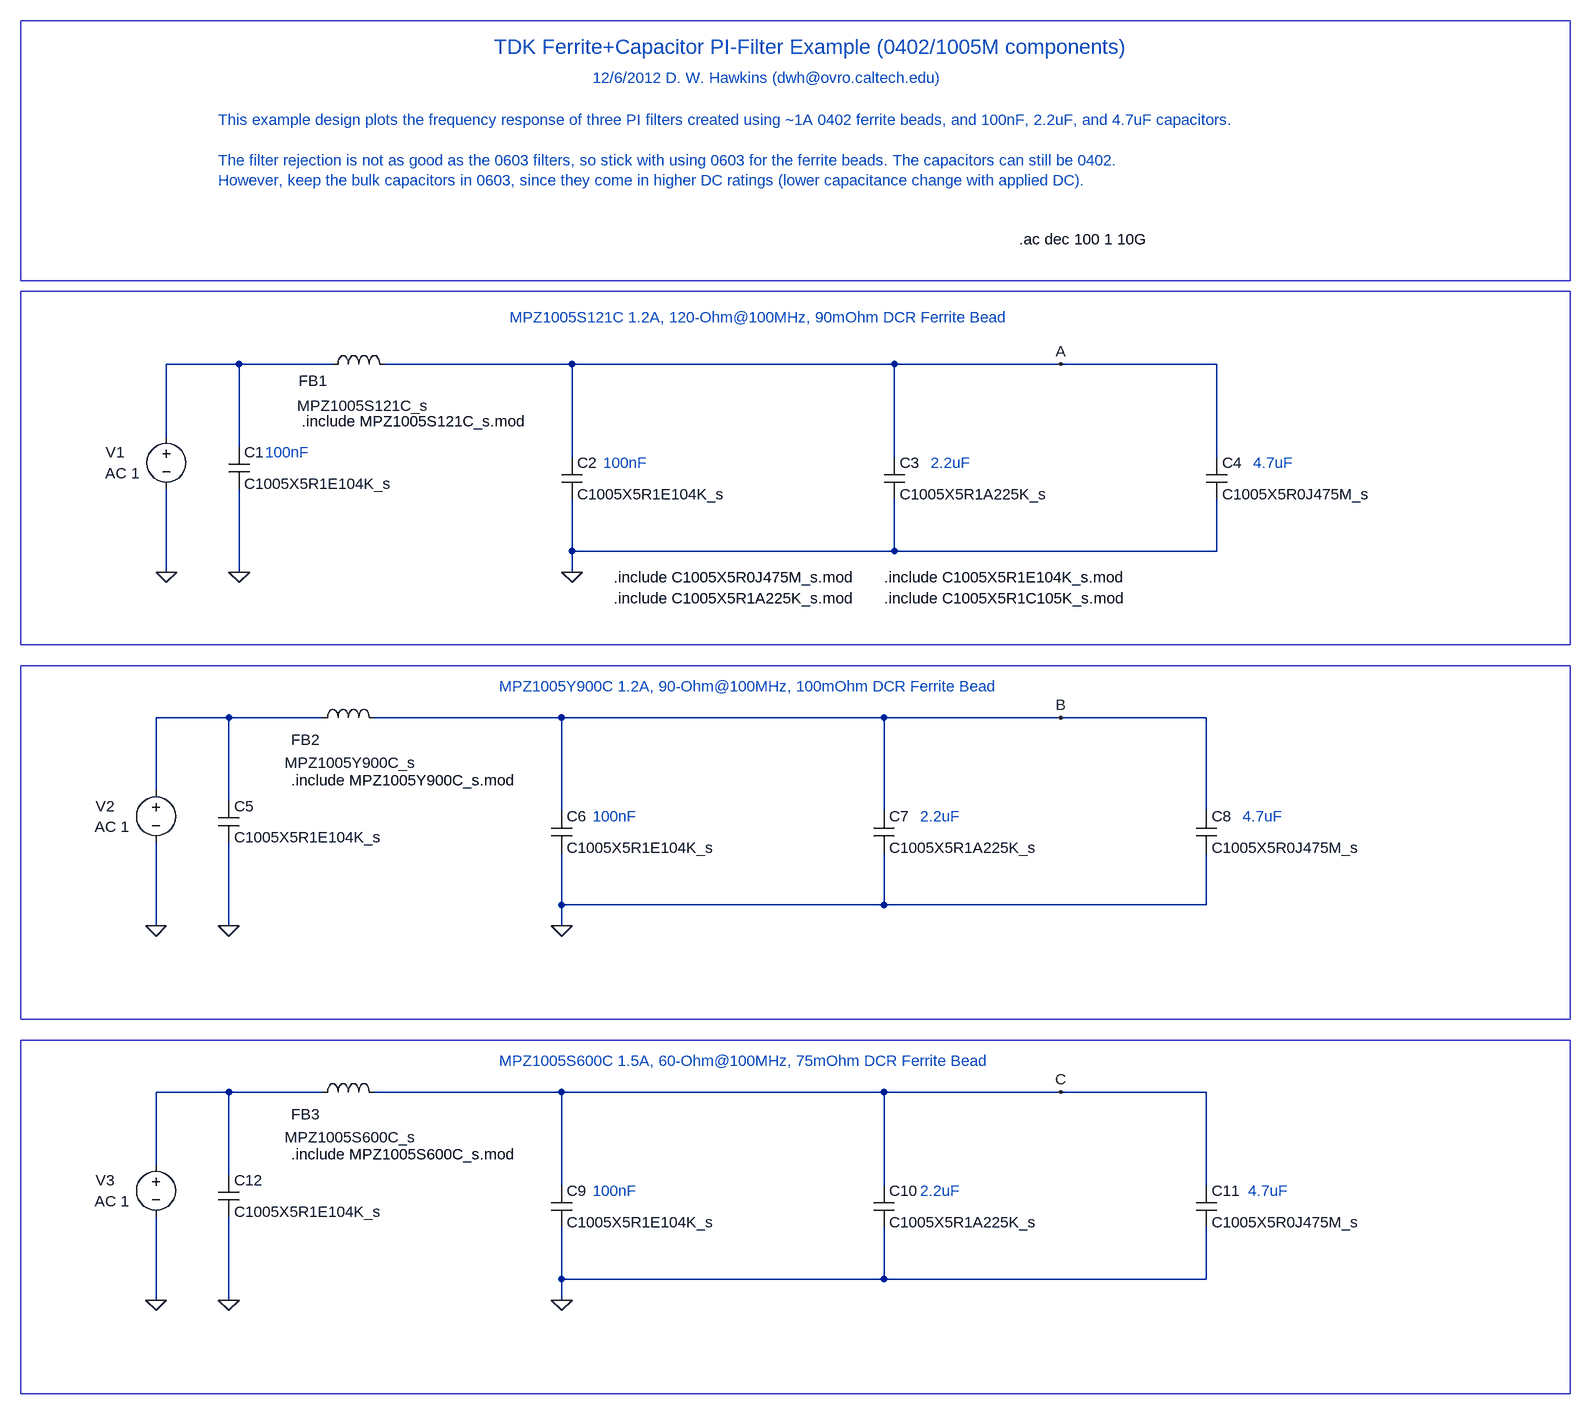
[diagram p0: schematic pi_filter_0402_1A.asc]
pi_filter_0402_1A.asc, the LTspice schematic file:
Version 4
SHEET 1 2492 2692
WIRE 304 -48 192 -48
WIRE 448 -48 304 -48
WIRE 816 -48 528 -48
WIRE 1312 -48 816 -48
WIRE 1568 -48 1312 -48
WIRE 1808 -48 1568 -48
WIRE 192 64 192 -48
WIRE 304 80 304 -48
WIRE 816 96 816 -48
WIRE 1312 96 1312 -48
WIRE 1808 96 1808 -48
WIRE 816 240 816 160
WIRE 1312 240 1312 160
WIRE 1312 240 816 240
WIRE 1808 240 1808 160
WIRE 1808 240 1312 240
WIRE 192 272 192 144
WIRE 304 272 304 144
WIRE 816 272 816 240
WIRE 288 496 176 496
WIRE 432 496 288 496
WIRE 800 496 512 496
WIRE 1296 496 800 496
WIRE 1568 496 1296 496
WIRE 1792 496 1568 496
WIRE 176 608 176 496
WIRE 288 624 288 496
WIRE 800 640 800 496
WIRE 1296 640 1296 496
WIRE 1792 640 1792 496
WIRE 800 784 800 704
WIRE 1296 784 1296 704
WIRE 1296 784 800 784
WIRE 1792 784 1792 704
WIRE 1792 784 1296 784
WIRE 176 816 176 688
WIRE 288 816 288 688
WIRE 800 816 800 784
WIRE 288 1072 176 1072
WIRE 432 1072 288 1072
WIRE 800 1072 512 1072
WIRE 1296 1072 800 1072
WIRE 1568 1072 1296 1072
WIRE 1792 1072 1568 1072
WIRE 176 1184 176 1072
WIRE 288 1200 288 1072
WIRE 800 1216 800 1072
WIRE 1296 1216 1296 1072
WIRE 1792 1216 1792 1072
WIRE 800 1360 800 1280
WIRE 1296 1360 1296 1280
WIRE 1296 1360 800 1360
WIRE 1792 1360 1792 1280
WIRE 1792 1360 1296 1360
WIRE 176 1392 176 1264
WIRE 288 1392 288 1264
WIRE 800 1392 800 1360
FLAG 192 272 0
FLAG 304 272 0
FLAG 816 272 0
FLAG 176 816 0
FLAG 288 816 0
FLAG 800 816 0
FLAG 1568 -48 A
FLAG 1568 496 B
FLAG 176 1392 0
FLAG 288 1392 0
FLAG 800 1392 0
FLAG 1568 1072 C
SYMBOL ind 432 -32 R270
WINDOW 0 -25 -14 VTop 2
WINDOW 3 -33 63 VBottom 2
SYMATTR InstName FB1
SYMATTR Value MPZ1005S121C_s
SYMATTR Prefix X
SYMBOL cap 800 96 R0
SYMATTR InstName C2
SYMATTR Value C1005X5R1E104K_s
SYMATTR Prefix X
SYMBOL cap 1296 96 R0
SYMATTR InstName C3
SYMATTR Value C1005X5R1A225K_s
SYMATTR Prefix X
SYMBOL cap 1792 96 R0
SYMATTR InstName C4
SYMATTR Value C1005X5R0J475M_s
SYMATTR Prefix X
SYMBOL cap 288 80 R0
SYMATTR InstName C1
SYMATTR Value C1005X5R1E104K_s
SYMATTR Prefix X
SYMBOL voltage 192 48 R0
WINDOW 0 -93 40 Left 2
WINDOW 123 -94 72 Left 2
WINDOW 39 0 0 Left 2
SYMATTR InstName V1
SYMATTR Value2 AC 1
SYMATTR Value ""
SYMBOL ind 416 512 R270
WINDOW 0 -34 -10 VTop 2
WINDOW 3 -38 60 VBottom 2
SYMATTR InstName FB2
SYMATTR Value MPZ1005Y900C_s
SYMATTR Prefix X
SYMBOL cap 784 640 R0
SYMATTR InstName C6
SYMATTR Value C1005X5R1E104K_s
SYMATTR Prefix X
SYMBOL cap 1280 640 R0
SYMATTR InstName C7
SYMATTR Value C1005X5R1A225K_s
SYMATTR Prefix X
SYMBOL cap 1776 640 R0
SYMATTR InstName C8
SYMATTR Value C1005X5R0J475M_s
SYMATTR Prefix X
SYMBOL cap 272 624 R0
SYMATTR InstName C5
SYMATTR Value C1005X5R1E104K_s
SYMATTR Prefix X
SYMBOL voltage 176 592 R0
WINDOW 0 -93 40 Left 2
WINDOW 123 -94 72 Left 2
WINDOW 39 0 0 Left 2
SYMATTR InstName V2
SYMATTR Value2 AC 1
SYMATTR Value ""
SYMBOL ind 416 1088 R270
WINDOW 0 -34 -10 VTop 2
WINDOW 3 -38 60 VBottom 2
SYMATTR InstName FB3
SYMATTR Value MPZ1005S600C_s
SYMATTR Prefix X
SYMBOL cap 784 1216 R0
SYMATTR InstName C9
SYMATTR Value C1005X5R1E104K_s
SYMATTR Prefix X
SYMBOL cap 1280 1216 R0
SYMATTR InstName C10
SYMATTR Value C1005X5R1A225K_s
SYMATTR Prefix X
SYMBOL cap 1776 1216 R0
SYMATTR InstName C11
SYMATTR Value C1005X5R0J475M_s
SYMATTR Prefix X
SYMBOL cap 272 1200 R0
SYMATTR InstName C12
SYMATTR Value C1005X5R1E104K_s
SYMATTR Prefix X
SYMBOL voltage 176 1168 R0
WINDOW 0 -93 40 Left 2
WINDOW 123 -94 72 Left 2
WINDOW 39 0 0 Left 2
SYMATTR InstName V3
SYMATTR Value2 AC 1
SYMATTR Value ""
TEXT 1504 -240 Left 2 !.ac dec 100 1 10G
TEXT 400 40 Left 2 !.include MPZ1005S121C_s.mod
TEXT 720 -120 Left 2 ;MPZ1005S121C 1.2A, 120-Ohm@100MHz, 90mOhm DCR Ferrite Bead
TEXT 704 448 Left 2 ;MPZ1005Y900C 1.2A, 90-Ohm@100MHz, 100mOhm DCR Ferrite Bead
TEXT 696 -536 Left 3 ;TDK Ferrite+Capacitor PI-Filter Example (0402/1005M components)
TEXT 848 -488 Left 2 ;12/6/2012 D. W. Hawkins (dwh@ovro.caltech.edu)
TEXT 272 -424 Left 2 ;This example design plots the frequency response of three PI filters created using ~1A 0402 ferrite beads, and 100nF, 2.2uF, and 4.7uF capacitors.\n \nThe filter rejection is not as good as the 0603 filters, so stick with using 0603 for the ferrite beads. The capacitors can still be 0402.\nHowever, keep the bulk capacitors in 0603, since they come in higher DC ratings (lower capacitance change with applied DC).
TEXT 880 280 Left 2 !.include C1005X5R0J475M_s.mod
TEXT 880 312 Left 2 !.include C1005X5R1A225K_s.mod
TEXT 384 592 Left 2 !.include MPZ1005Y900C_s.mod
TEXT 704 1024 Left 2 ;MPZ1005S600C 1.5A, 60-Ohm@100MHz, 75mOhm DCR Ferrite Bead
TEXT 384 1168 Left 2 !.include MPZ1005S600C_s.mod
TEXT 1296 280 Left 2 !.include C1005X5R1E104K_s.mod
TEXT 1296 312 Left 2 !.include C1005X5R1C105K_s.mod
TEXT 344 88 Left 2 ;100nF
TEXT 864 104 Left 2 ;100nF
TEXT 848 1224 Left 2 ;100nF
TEXT 848 648 Left 2 ;100nF
TEXT 1352 1224 Left 2 ;2.2uF
TEXT 1352 648 Left 2 ;2.2uF
TEXT 1856 1224 Left 2 ;4.7uF
TEXT 1848 648 Left 2 ;4.7uF
TEXT 1864 104 Left 2 ;4.7uF
TEXT 1368 104 Left 2 ;2.2uF
RECTANGLE Normal 2352 384 -32 -160
RECTANGLE Normal 2352 -176 -32 -576
RECTANGLE Normal 2352 960 -32 416
RECTANGLE Normal 2352 1536 -32 992

The netlist it stands for:
* pi_filter_0402_1A.asc
XFB1 N001 A MPZ1005S121C_s  ; pins A B
XC2 A 0 C1005X5R1E104K_s  ; pins A B
XC3 A 0 C1005X5R1A225K_s  ; pins A B
XC4 A 0 C1005X5R0J475M_s  ; pins A B
XC1 N001 0 C1005X5R1E104K_s  ; pins A B
V1 N001 0 AC 1
XFB2 N002 B MPZ1005Y900C_s  ; pins A B
XC6 B 0 C1005X5R1E104K_s  ; pins A B
XC7 B 0 C1005X5R1A225K_s  ; pins A B
XC8 B 0 C1005X5R0J475M_s  ; pins A B
XC5 N002 0 C1005X5R1E104K_s  ; pins A B
V2 N002 0 AC 1
XFB3 N003 C MPZ1005S600C_s  ; pins A B
XC9 C 0 C1005X5R1E104K_s  ; pins A B
XC10 C 0 C1005X5R1A225K_s  ; pins A B
XC11 C 0 C1005X5R0J475M_s  ; pins A B
XC12 N003 0 C1005X5R1E104K_s  ; pins A B
V3 N003 0 AC 1
.ac dec 100 1 10G
.include MPZ1005S121C_s.mod
* MPZ1005S121C 1.2A, 120-Ohm@100MHz, 90mOhm DCR Ferrite Bead
* MPZ1005Y900C 1.2A, 90-Ohm@100MHz, 100mOhm DCR Ferrite Bead
* TDK Ferrite+Capacitor PI-Filter Example (0402/1005M components)
* 12/6/2012 D. W. Hawkins (dwh@ovro.caltech.edu)
* This example design plots the frequency response of three PI filters created using ~1A 0402 ferrite beads, and 100nF, 2.2uF, and 4.7uF capacitors.
* The filter rejection is not as good as the 0603 filters, so stick with using 0603 for the ferrite beads. The capacitors can still be 0402.
* However, keep the bulk capacitors in 0603, since they come in higher DC ratings (lower capacitance change with applied DC).
.include C1005X5R0J475M_s.mod
.include C1005X5R1A225K_s.mod
.include MPZ1005Y900C_s.mod
* MPZ1005S600C 1.5A, 60-Ohm@100MHz, 75mOhm DCR Ferrite Bead
.include MPZ1005S600C_s.mod
.include C1005X5R1E104K_s.mod
.include C1005X5R1C105K_s.mod
* 100nF
* 100nF
* 100nF
* 100nF
* 2.2uF
* 2.2uF
* 4.7uF
* 4.7uF
* 4.7uF
* 2.2uF
.backanno
.end